# Altium schematic sheet button.SchDoc
size A4; SheetNumber: 7; SheetTotal: 8
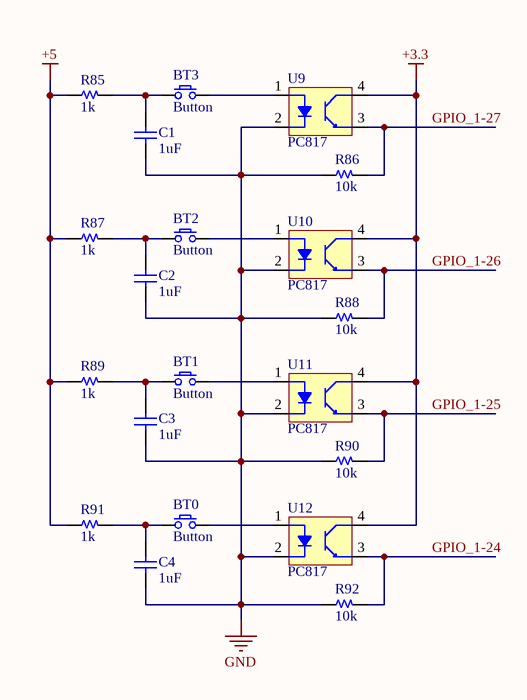
[diagram p0: button.SchDoc]

## Parts
BT0  Button  [SW/4/SMD/XS]
BT1  Button  [SW/4/SMD/XS]
BT2  Button  [SW/4/SMD/XS]
BT3  Button  [SW/4/SMD/XS]
C1  1uF  [C 0603]
C2  1uF  [C 0603]
C3  1uF  [C 0603]
C4  1uF  [C 0603]
R85  1k  [R 0603]
R86  10k  [R 0603]
R87  1k  [R 0603]
R88  10k  [R 0603]
R89  1k  [R 0603]
R90  10k  [R 0603]
R91  1k  [R 0603]
R92  10k  [R 0603]
U9  PC817  [SOP4 - PC817]
U10  PC817  [SOP4 - PC817]
U11  PC817  [SOP4 - PC817]
U12  PC817  [SOP4 - PC817]

## Nets
+3.3: U9.4(C) U10.4(C) U11.4(C) U12.4(C)
+5: R85.1 R87.1 R89.1 R91.1
GND: C1.1 C2.1 C3.1 C4.1 R86.1 R88.1 R90.1 R92.1 U9.2(K) U10.2(K) U11.2(K) U12.2(K)
GPIO_1-24: R92.2 U12.3(E)
GPIO_1-25: R90.2 U11.3(E)
GPIO_1-26: R88.2 U10.3(E)
GPIO_1-27: R86.2 U9.3(E)
NetBT0_1: BT0.1 C4.2 R91.2
NetBT0_2: BT0.2 U12.1(A)
NetBT1_1: BT1.1 C3.2 R89.2
NetBT1_2: BT1.2 U11.1(A)
NetBT2_1: BT2.1 C2.2 R87.2
NetBT2_2: BT2.2 U10.1(A)
NetBT3_1: BT3.1 C1.2 R85.2
NetBT3_2: BT3.2 U9.1(A)

## Library data of the parts
BT0-BT3 = SW SPST: Tact switch 2 pin
C1-C4 = Capacitor NP: Capacitor non-pol
R85-R92 = Resistor
U9-U12 = PC817: Opto PC817B